# Altium schematic sheet SUPPLY.SchDoc: AMF CONTROLELR GC12
size A4; DrawnBy: SURAJ; Engineer: SURAJ; SheetNumber: 9
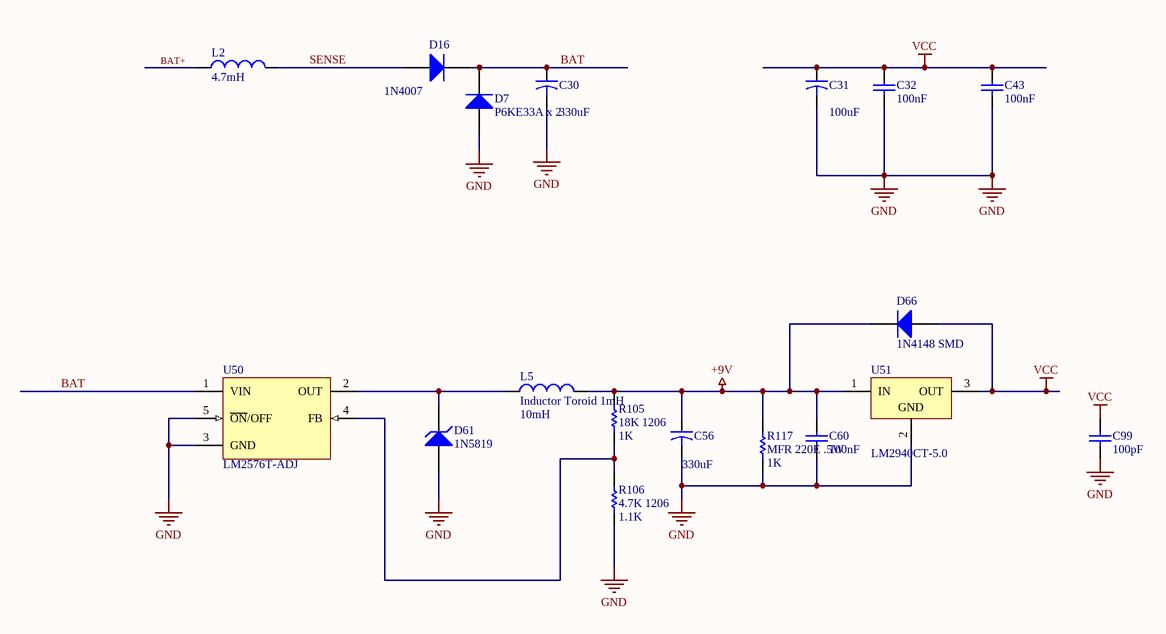
[diagram p0: SUPPLY.SchDoc]

## Parts
C30  value 330uF  [Cap_.2-2]  (hidden comment: Cap Electrolitic 1000uF/50V)
C31  value 100uF  [Cap_.2]  (hidden comment: Cap Electrolytic 470uF/16V)
C32  value 100nF  [C1206VW]  (hidden comment: .1uF 1206)
C43  value 100nF  [C1206VW]  (hidden comment: 1uF 1206)
C56  value 330uF  [Cap_.3]  (hidden comment: Cap Electrolitic 3300uF/16V)
C60  value 100nF  [C1206VW]  (hidden comment: .1uF 1206)
C99  value 100pF  [C1206VW]  (hidden comment: .1uF 1206)
D7  P6KE33A x 2  [DIODE1A]
D16  1N4007  [DIODE1A]
D61  1N5819  [DIODE1A]
D66  1N4148 SMD  [4148SMD]
L2  value 4.7mH  [INDUCTOR]  (hidden comment: Inductor 220uH)
L5  Inductor Toroid 1mH  value 10mH  [INDUCTORTOROID]
R105  18K 1206  value 1K  [R1206VW]
R106  4.7K 1206  value 1.1K  [R1206VW]
R117  MFR 220E .5W  value 1K  [AXIAL-0.5]
U50  LM2576T-ADJ  [T05D]
U51  LM2940CT-5.0  [T03B]

## Nets
+9V: C56.1 C60.2 D66.2(K) L5.2 R105.2 R117.2 U51.1(IN)
GND: C30.2 C31.2 C32.1 C43.1 C56.2 C60.1 C99.1 D7.1(A) D61.1(A) R106.1 R117.1 U50.3(GND) U50.5(~{ON}/OFF) U51.2(GND)
VCC: C31.1 C32.2 C43.2 C99.2 D66.1(A) U51.3(OUT)
BAT: C30.1 D7.2(K) D16.2(K) U50.1(VIN)
BAT+: L2.1
SENSE: D16.1(A) L2.2
NetD61_2: D61.2(K) L5.1 U50.2(OUT)
NetR105_1: R105.1 R106.2 U50.4(FB)

## Notes on the sheet
- Title:
- Date:
- Sheet
- of
- Engineer:

## Library data of the parts
C30 C31 C56 = Cap2: Capacitor; Published: 23-Sep-2002; PackageReference: CAPR5-4X5; Publisher: Altium Limited
C32 C43 C60 = CAP: Capacitor; Published: 8-Jun-2000; LatestRevisionDate: 17-Jul-2002; LatestRevisionNote: Re-released for DXP Platform.; PackageReference: RAD-0.3; Publisher: Altium Limited; PackageDescription: Radial Cap, Thru-Hole; 2 Leads; 0.3 in Pin Spacing
C99 = Cap: Capacitor; Published: 8-Jun-2000; LatestRevisionDate: 17-Jul-2002; LatestRevisionNote: Re-released for DXP Platform.; PackageReference: RAD-0.3; Publisher: Altium Limited; PackageDescription: Radial Cap, Thru-Hole; 2 Leads; 0.3 in Pin Spacing
D7 D16 = Diode 1N5408: 3 Amp Medium Power Silicon Rectifier Diode; Published: 8-Jun-2000; LatestRevisionDate: 17-Jul-2002; LatestRevisionNote: Re-released for DXP Platform.; DatasheetVersion: Aug-1984; PackageReference: DO-201AD; Publisher: Altium Limited; PackageDescription: Diode, Axial; Body 9.5 x 5.3 mm (LxDia. max), Lead Dia. 1.32 mm (max); ComponentLink1Description: Manufacturer Link; ComponentLink1URL: http://www.irf.com/
D61 = 1N5221B: Silicon Zener Diode (0.3 to 0.5W); Published: 8-Jun-2000; LatestRevisionDate: 17-Jul-2002; LatestRevisionNote: Re-released for DXP Platform.; DatasheetDocument: 6-Aug-1999; PackageReference: DO-35; Publisher: Altium Limited; Code_JEDEC: DO-204-AH; ComponentLink1Description: Manufacturer Link; ComponentLink1URL: http://www.vishay.com/; ComponentLink2Description: Datasheet; ComponentLink2URL: http://www.vishay.com/docs/85588/85588.pdf
D66 = Diode 1N5408: Small Signal Fast Switching Diode; Published: 8-Jun-2000; LatestRevisionDate: 17-Jul-2002; LatestRevisionNote: Re-released for DXP Platform.; DatasheetVersion: Aug-1984; PackageReference: DO-201AD; Publisher: Altium Limited; PackageDescription: Diode, Axial; Body 9.5 x 5.3 mm (LxDia. max), Lead Dia. 1.32 mm (max); ComponentLink1Description: Manufacturer Link; ComponentLink1URL: http://www.irf.com/
L2 L5 = Inductor: Code_IEC: 1005; Published: 8-Jun-2000; LatestRevisionDate: 29-May-2009; LatestRevisionNote: IPC-7351 Footprint Added.; PackageReference: 0402-A; Publisher: Altium Limited; PackageDescription: Chip Inductor; Code_JEITA: 0402
R105 R106 = Res SMT: Semiconductor Resistor; Published: 8-Jun-2000; LatestRevisionDate: 17-Jul-2002; LatestRevisionNote: Re-released for DXP Platform.; PackageReference: AXIAL-0.5; Publisher: Altium Limited; PackageDescription: Axial Device, Thru-Hole; 2 Leads; 0.5 in Pin Spacing
R117 = Res Semi: Semiconductor Resistor; Published: 8-Jun-2000; LatestRevisionDate: 17-Jul-2002; LatestRevisionNote: Re-released for DXP Platform.; PackageReference: AXIAL-0.5; Publisher: Altium Limited; PackageDescription: Axial Device, Thru-Hole; 2 Leads; 0.5 in Pin Spacing
U50 = LM2576T-ADJ: SIMPLE SWITCHER® 3A Step-Down Voltage Regulator, 5-pin TO-220; Manufacturer: National Semiconductor; PackageTopMarking: NSUZXYTTE#*LM2576T*-ADJ P+; PowerWise: N; Published: 4-Dec-2008; DatasheetVersion: Aug-2004; PackageVersion: revJ, Jan-1992; PackageReference: T05A; Publisher: Altium Limited; PackageDescription: TO-220, Molded, 5 Lead, Straight; Supplier 1: Farnell; Supplier Part Number 1: 9488146; PartNumber: LM2576T-ADJ; RoHS: N; PinCount: 5; CompType: Switcher; Code_JEDEC: TO-220-AB; ComponentLink1Description: LM2576 Datasheet; ComponentLink1URL: http://www.national.com/ds/LM/LM2576.pdf; ComponentLink2Description: LM2576 Web Page; ComponentLink2URL: http://www.national.com/pf/LM/LM2576.html; ComponentLink3Description: T05A Package Page; ComponentLink3URL: http://www.national.com/packaging/folders/t05a.html
U51 = LM2940CT-5.0: 1A Low Dropout Regulator, 3-pin TO-220; Manufacturer: National Semiconductor; PackageTopMarking: NSUZXYTTE#*LM2940CT*-5.0 P+; PowerWise: N; CompType: LDO IC; Published: 4-Dec-2008; DatasheetVersion: Jan-2007; PackageVersion: revL, Jan-1992; PackageReference: T03B; Publisher: Altium Limited; PackageDescription: TO-220, Molded, 3 Lead, Straight; Supplier 1: Farnell; Supplier Part Number 1: 9490191; Supplier 2: Farnell; Supplier Part Number 2: 1523853; PartNumber: LM2940CT-5.0; RoHS: N; PinCount: 3; ComponentLink1Description: LM2940C Datasheet; ComponentLink1URL: http://www.national.com/ds/LM/LM2940C.pdf; ComponentLink2Description: LM2940C Web Page; ComponentLink2URL: http://www.national.com/pf/LM/LM2940C.html; ComponentLink3Description: T03B Package Page; ComponentLink3URL: http://www.national.com/packaging/folders/t03b.html